# Altium project USBasp.PrjPCB
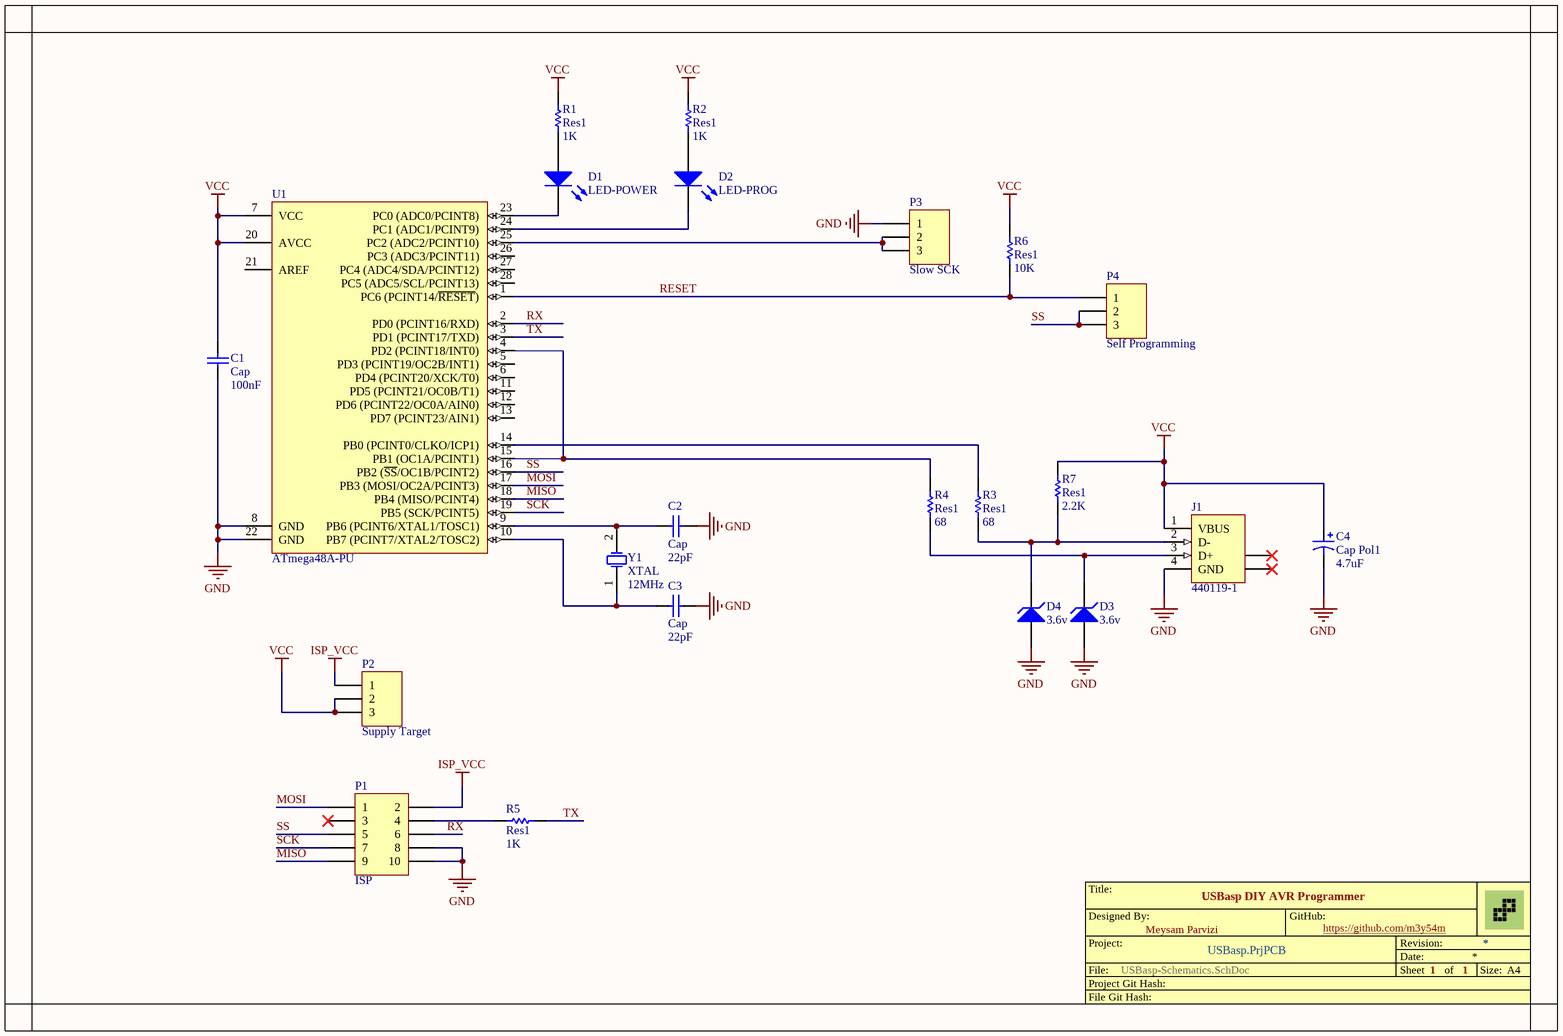
[diagram p0: USBasp-Schematics.SchDoc]
1 sheet, 22 parts. Net scope: global (net labels, ports and power ports of the same name join across sheets).
Board file: USBasp-PCB.PcbDoc

## Sheet USBasp-Schematics.SchDoc: USBasp DIY AVR Programmer
size A4; Author: Meysam Parvizi; DrawnBy: Meysam Parvizi; SheetNumber: 1; SheetTotal: 1; PageSetup: Record=PageOptions|CenterHorizontal=True|CenterVertical=True|PrintScale=1.00|XCorrection=1.00|YCorrection=1.00|PrintKind=1|BorderSize=5000000|LeftOffset=0|BottomOffset=0|Orientation=2|PaperLength=1000|PaperWidth=1000|Scale=100|PaperSource=7|PrintQuality=-3|MediaType=1|DitherType=10|PrintScaleMode=1|PaperKind=A4|PaperIndex=9

### Parts
C1  Cap  value 100nF  [RAD-0.1]
C2  Cap  value 22pF  [RAD-0.1]
C3  Cap  value 22pF  [RAD-0.1]
C4  Cap Pol1  value 4.7uF  [CAP1]
D1  LED-POWER  [LED1]
D2  LED-PROG  [LED1]
D3  3.6v  [DO-35]
D4  3.6v  [DO-35]
J1  440119-1  [440119]
P1  ISP  [BOX2X5]
P2  Supply Target  [HDR1X3]
P3  Slow SCK  [HDR1X3]
P4  Self Programming  [HDR1X3]
R1  Res1  value 1K  [AXIAL-0.3]
R2  Res1  value 1K  [AXIAL-0.3]
R3  Res1  value 68  [AXIAL-0.3]
R4  Res1  value 68  [AXIAL-0.3]
R5  Res1  value 1K  [AXIAL-0.3]
R6  Res1  value 10K  [AXIAL-0.3]
R7  Res1  value 2.2K  [AXIAL-0.3]
U1  ATmega48A-PU  [28P3]
Y1  XTAL  value 12MHz  [XTAL]

### Nets
GND: C1.1 C2.2 C3.2 C4.2 D3.1(A) D4.1(A) J1.4(GND) P1.8 P1.10 P3.1 U1.8(GND) U1.22(GND)
ISP_VCC: P1.2 P2.1
VCC: C1.2 C4.1 J1.1(VBUS) P2.2 P2.3 R1.2 R2.2 R6.2 R7.2 U1.7(VCC) U1.20(AVCC)
MISO: P1.9 U1.18(PB4_(MISO/PCINT4))
MOSI: P1.1 U1.17(PB3_(MOSI/OC2A/PCINT3))
RESET: P4.1 R6.1 U1.1(PC6_(PCINT14/~{RESET}))
RX: P1.6 U1.2(PD0_(PCINT16/RXD))
SCK: P1.7 U1.19(PB5_(SCK/PCINT5))
SS: P1.5 P4.2 P4.3 U1.16(PB2_(~{SS}/OC1B/PCINT2))
TX: R5.2 U1.3(PD1_(PCINT17/TXD))
NetC2_1: C2.1 U1.9(PB6_(PCINT6/XTAL1/TOSC1)) Y1.2(OSC2)
NetC3_1: C3.1 U1.10(PB7_(PCINT7/XTAL2/TOSC2)) Y1.1(OSC1)
NetD1_1: D1.1(A) R1.1
NetD1_2: D1.2(K) U1.23(PC0_(ADC0/PCINT8))
NetD2_1: D2.1(A) R2.1
NetD2_2: D2.2(K) U1.24(PC1_(ADC1/PCINT9))
NetD3_2: D3.2(K) J1.3(D+) R4.1
NetD4_2: D4.2(K) J1.2(D-) R3.1 R7.1
NetP1_4: P1.4 R5.1
NetP3_2: P3.2 P3.3 U1.25(PC2_(ADC2/PCINT10))
NetR3_2: R3.2 U1.14(PB0_(PCINT0/CLKO/ICP1))
NetR4_2: R4.2 U1.4(PD2_(PCINT18/INT0)) U1.15(PB1_(OC1A/PCINT1))

Not connected (* = marked no-connect by the designer): J1 5(SHLD)* 6(SHLD)*; P1 3*; U1 5(PD3_(PCINT19/OC2B/INT1)) 6(PD4_(PCINT20/XCK/T0)) 11(PD5_(PCINT21/OC0B/T1)) 12(PD6_(PCINT22/OC0A/AIN0)) 13(PD7_(PCINT23/AIN1)) 21(AREF) 26(PC3_(ADC3/PCINT11)) 27(PC4_(ADC4/SDA/PCINT12)) 28(PC5_(ADC5/SCL/PCINT13))

### Notes on the sheet
- Title:
- Designed By:
- Meysam Parvizi
- GitHub:
- https://github.com/m3y54m
- File:
- Project Git Hash:
- Project:
- Date:
- Sheet
- Revision:
- of
- Size:
- A4
- File Git Hash:

### Library data of the parts
C1-C3 = Cap: Capacitor; Published: 8-Jun-2000; LatestRevisionDate: 17-Jul-2002; LatestRevisionNote: Re-released for DXP Platform.; PackageReference: RAD-0.3; Publisher: Altium Limited; PackageDescription: Radial Cap, Thru-Hole; 2 Leads; 0.3 in Pin Spacing
C4 = Cap Pol1: Polarized Capacitor (Radial); Published: 8-Jun-2000; LatestRevisionDate: 17-Jul-2002; LatestRevisionNote: Re-released for DXP Platform.; PackageReference: RB7.6-15; Publisher: Altium Limited; PackageDescription: Polarized Capacitor (Radial); 2 Leads
D1 D2 = LED: Typical RED GaAs LED; Designer: Meysam Parvizi; Email: meysam.parvizi.ir@gmail.com; Weblog: http://mp.tabin.ir
D3 D4 = D Zener: Zener Diode; Published: 8-Jun-2000; LatestRevisionDate: 17-Jul-2002; LatestRevisionNote: Re-released for DXP Platform.; PackageReference: DIODE-0.7; Publisher: Altium Limited; PackageDescription: Diode, Thru-Hole; 2 Leads; 0.7 in Pin Spacing
J1 = 440119-1: USB 1.1, Right Angle, Thru-Hole, B Type, Receptacle, 4 Position, Beige; ContactMaterial: Copper Alloy; ContactPlating: Gold Flash over Nickel; TerminationLength: 2.84mm [0.112in.]; PCB_Layout: Complies with manufacturer's recommendation.; DrillSize: Corresponds to nominal value.; PanelGround: Without; Published: 15-Jul-2004; DatasheetDocument: 12-Jan-2004; PackageDocument: 12-Jan-2004; PackageReference: 440119; Publisher: Altium Limited; HousingMaterial: Thermoplastic; ComponentLink1Description: Manufacturer Link; ComponentLink1URL: http://www.tycoelectronics.com/; ComponentLink2Description: Packaging Specification; ComponentLink2URL: http://ecommas.tycoelectronics.com/commerce/DocumentDelivery/DDEController?Action=showdoc&DocId=Customer+Drawing%7F440119%7FC%7Ftif%7FEnglish%7FC_440119_C.tif
P1 = Box 5X2: Box, 5-Pin, Dual row; Designer: Meysam Parvizi; Email: meysam.parvizi.ir@gmail.com; Weblog: http://mp.tabin.ir
P2-P4 = Header 3: Header, 3-Pin; LatestRevisionDate: 17-Jul-2002; LatestRevisionNote: Re-released for DXP Platform.; Publisher: Altium Limited
R1-R7 = Res1: Resistor; Published: 8-Jun-2000; LatestRevisionDate: 17-Jul-2002; LatestRevisionNote: Re-released for DXP Platform.; PackageReference: AXIAL-0.3; Publisher: Altium Limited; PackageDescription: Axial Device, Thru-Hole; 2 Leads; 0.3 in Pin Spacing
U1 = ATmega48A-PU: 8-bit AVR Microcontroller, 4KB Flash, 256 Bytes EEPROM, 512 Bytes SRAM, 28-pin PDIP, Industrial Grade (-40°C to 85°C); DatasheetVersion: revD, May-2011; PackageVersion: revB, Sep-2001; PackageReference: 28P3; PackageDescription: 28-lead (0.300"/7.62mm Wide) Plastic Dual Inline Package (PDIP); ComponentLink1Description: Manufacturer URL; ComponentLink1URL: http://www.atmel.com/; ComponentLink2Description: ATmega48A/48PA/88A/88PA/168A/168PA/328/328P Datasheet; ComponentLink2URL: http://www.atmel.com/dyn/resources/prod_documents/8271.pdf; ComponentLink3Description: ATmega48A/48PA/88A/88PA/168A/168PA/328/328P Summary; ComponentLink3URL: http://www.atmel.com/dyn/resources/prod_documents/8271S.pdf
Y1 = XTAL: Crystal Oscillator; Designer: Meysam Parvizi; Email: meysam.parvizi.ir@gmail.com; Weblog: http://mp.tabin.ir